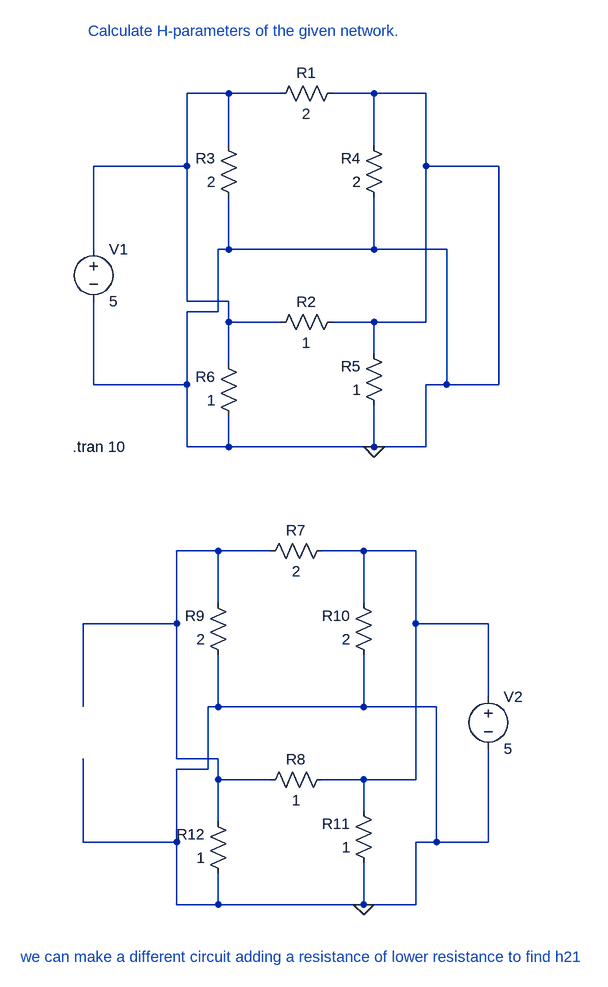
[diagram p0: schematic Lab7_ques5.asc]
Lab7_ques5.asc, the LTspice schematic file:
Version 4
SHEET 1 880 1552
WIRE 192 208 128 208
WIRE 272 208 192 208
WIRE 416 208 352 208
WIRE 496 208 416 208
WIRE 192 288 192 208
WIRE 416 288 416 208
WIRE 128 320 128 208
WIRE 128 320 -16 320
WIRE 496 320 496 208
WIRE 608 320 496 320
WIRE -16 448 -16 320
WIRE 192 448 192 368
WIRE 192 448 176 448
WIRE 416 448 416 368
WIRE 416 448 192 448
WIRE 528 448 416 448
WIRE 128 528 128 320
WIRE 192 528 128 528
WIRE 176 544 176 448
WIRE 176 544 128 544
WIRE 192 560 192 528
WIRE 272 560 192 560
WIRE 416 560 352 560
WIRE 496 560 496 320
WIRE 496 560 416 560
WIRE 416 608 416 560
WIRE 192 624 192 560
WIRE -16 656 -16 528
WIRE 128 656 128 544
WIRE 128 656 -16 656
WIRE 528 656 528 448
WIRE 528 656 496 656
WIRE 608 656 608 320
WIRE 608 656 528 656
WIRE 128 752 128 656
WIRE 192 752 192 704
WIRE 192 752 128 752
WIRE 416 752 416 688
WIRE 416 752 192 752
WIRE 496 752 496 656
WIRE 496 752 416 752
WIRE 176 912 112 912
WIRE 256 912 176 912
WIRE 400 912 336 912
WIRE 480 912 400 912
WIRE 176 992 176 912
WIRE 400 992 400 912
WIRE 112 1024 112 912
WIRE 112 1024 -32 1024
WIRE 480 1024 480 912
WIRE 592 1024 480 1024
WIRE 592 1136 592 1024
WIRE -32 1152 -32 1024
WIRE 176 1152 176 1072
WIRE 176 1152 160 1152
WIRE 400 1152 400 1072
WIRE 400 1152 176 1152
WIRE 512 1152 400 1152
WIRE 112 1232 112 1024
WIRE 176 1232 112 1232
WIRE 160 1248 160 1152
WIRE 160 1248 112 1248
WIRE 176 1264 176 1232
WIRE 256 1264 176 1264
WIRE 400 1264 336 1264
WIRE 480 1264 480 1024
WIRE 480 1264 400 1264
WIRE 400 1312 400 1264
WIRE 176 1328 176 1264
WIRE -32 1360 -32 1232
WIRE 112 1360 112 1248
WIRE 112 1360 -32 1360
WIRE 512 1360 512 1152
WIRE 512 1360 480 1360
WIRE 592 1360 592 1216
WIRE 592 1360 512 1360
WIRE 112 1456 112 1360
WIRE 176 1456 176 1408
WIRE 176 1456 112 1456
WIRE 400 1456 400 1392
WIRE 400 1456 176 1456
WIRE 480 1456 480 1360
WIRE 480 1456 400 1456
FLAG 416 752 0
FLAG 400 1456 0
SYMBOL Res 368 192 R90
WINDOW 0 0 56 VBottom 2
WINDOW 3 32 56 VTop 2
SYMATTR InstName R1
SYMATTR Value 2
SYMBOL Res 368 544 R90
WINDOW 0 0 56 VBottom 2
WINDOW 3 32 56 VTop 2
SYMATTR InstName R2
SYMATTR Value 1
SYMBOL Res 208 384 R180
WINDOW 0 36 76 Left 2
WINDOW 3 36 40 Left 2
SYMATTR InstName R3
SYMATTR Value 2
SYMBOL Res 432 384 R180
WINDOW 0 36 76 Left 2
WINDOW 3 36 40 Left 2
SYMATTR InstName R4
SYMATTR Value 2
SYMBOL Res 432 704 R180
WINDOW 0 36 76 Left 2
WINDOW 3 36 40 Left 2
SYMATTR InstName R5
SYMATTR Value 1
SYMBOL Res 208 720 R180
WINDOW 0 36 76 Left 2
WINDOW 3 36 40 Left 2
SYMATTR InstName R6
SYMATTR Value 1
SYMBOL Voltage -16 432 R0
SYMATTR InstName V1
SYMATTR Value 5
SYMBOL Res 352 896 R90
WINDOW 0 0 56 VBottom 2
WINDOW 3 32 56 VTop 2
SYMATTR InstName R7
SYMATTR Value 2
SYMBOL Res 352 1248 R90
WINDOW 0 0 56 VBottom 2
WINDOW 3 32 56 VTop 2
SYMATTR InstName R8
SYMATTR Value 1
SYMBOL Res 192 1088 R180
WINDOW 0 36 76 Left 2
WINDOW 3 36 40 Left 2
SYMATTR InstName R9
SYMATTR Value 2
SYMBOL Res 416 1088 R180
WINDOW 0 36 76 Left 2
WINDOW 3 36 40 Left 2
SYMATTR InstName R10
SYMATTR Value 2
SYMBOL Res 416 1408 R180
WINDOW 0 36 76 Left 2
WINDOW 3 36 40 Left 2
SYMATTR InstName R11
SYMATTR Value 1
SYMBOL Res 192 1424 R180
WINDOW 0 36 76 Left 2
WINDOW 3 36 40 Left 2
SYMATTR InstName R12
SYMATTR Value 1
SYMBOL Voltage 592 1120 R0
SYMATTR InstName V2
SYMATTR Value 5
TEXT -24 112 Left 2 ;Calculate H-parameters of the given network.
TEXT -48 752 Left 2 !.tran 10
TEXT -128 1536 Left 2 ;we can make a different circuit adding a resistance of lower resistance to find h21

The netlist it stands for:
* Lab7_ques5.asc
R1 0 N001 2
R2 0 N001 1
R3 0 N001 2
R4 0 0 2
R5 0 0 1
R6 0 N001 1
V1 N001 0 5
R7 N003 N002 2
R8 N003 N002 1
R9 0 N002 2
R10 0 N003 2
R11 0 N003 1
R12 0 N002 1
V2 N003 0 5
* Calculate H-parameters of the given network.
.tran 10
* we can make a different circuit adding a resistance of lower resistance to find h21
.backanno
.end